# Altium schematic sheet PAGE1-CONTENTS.SchDoc
size A3
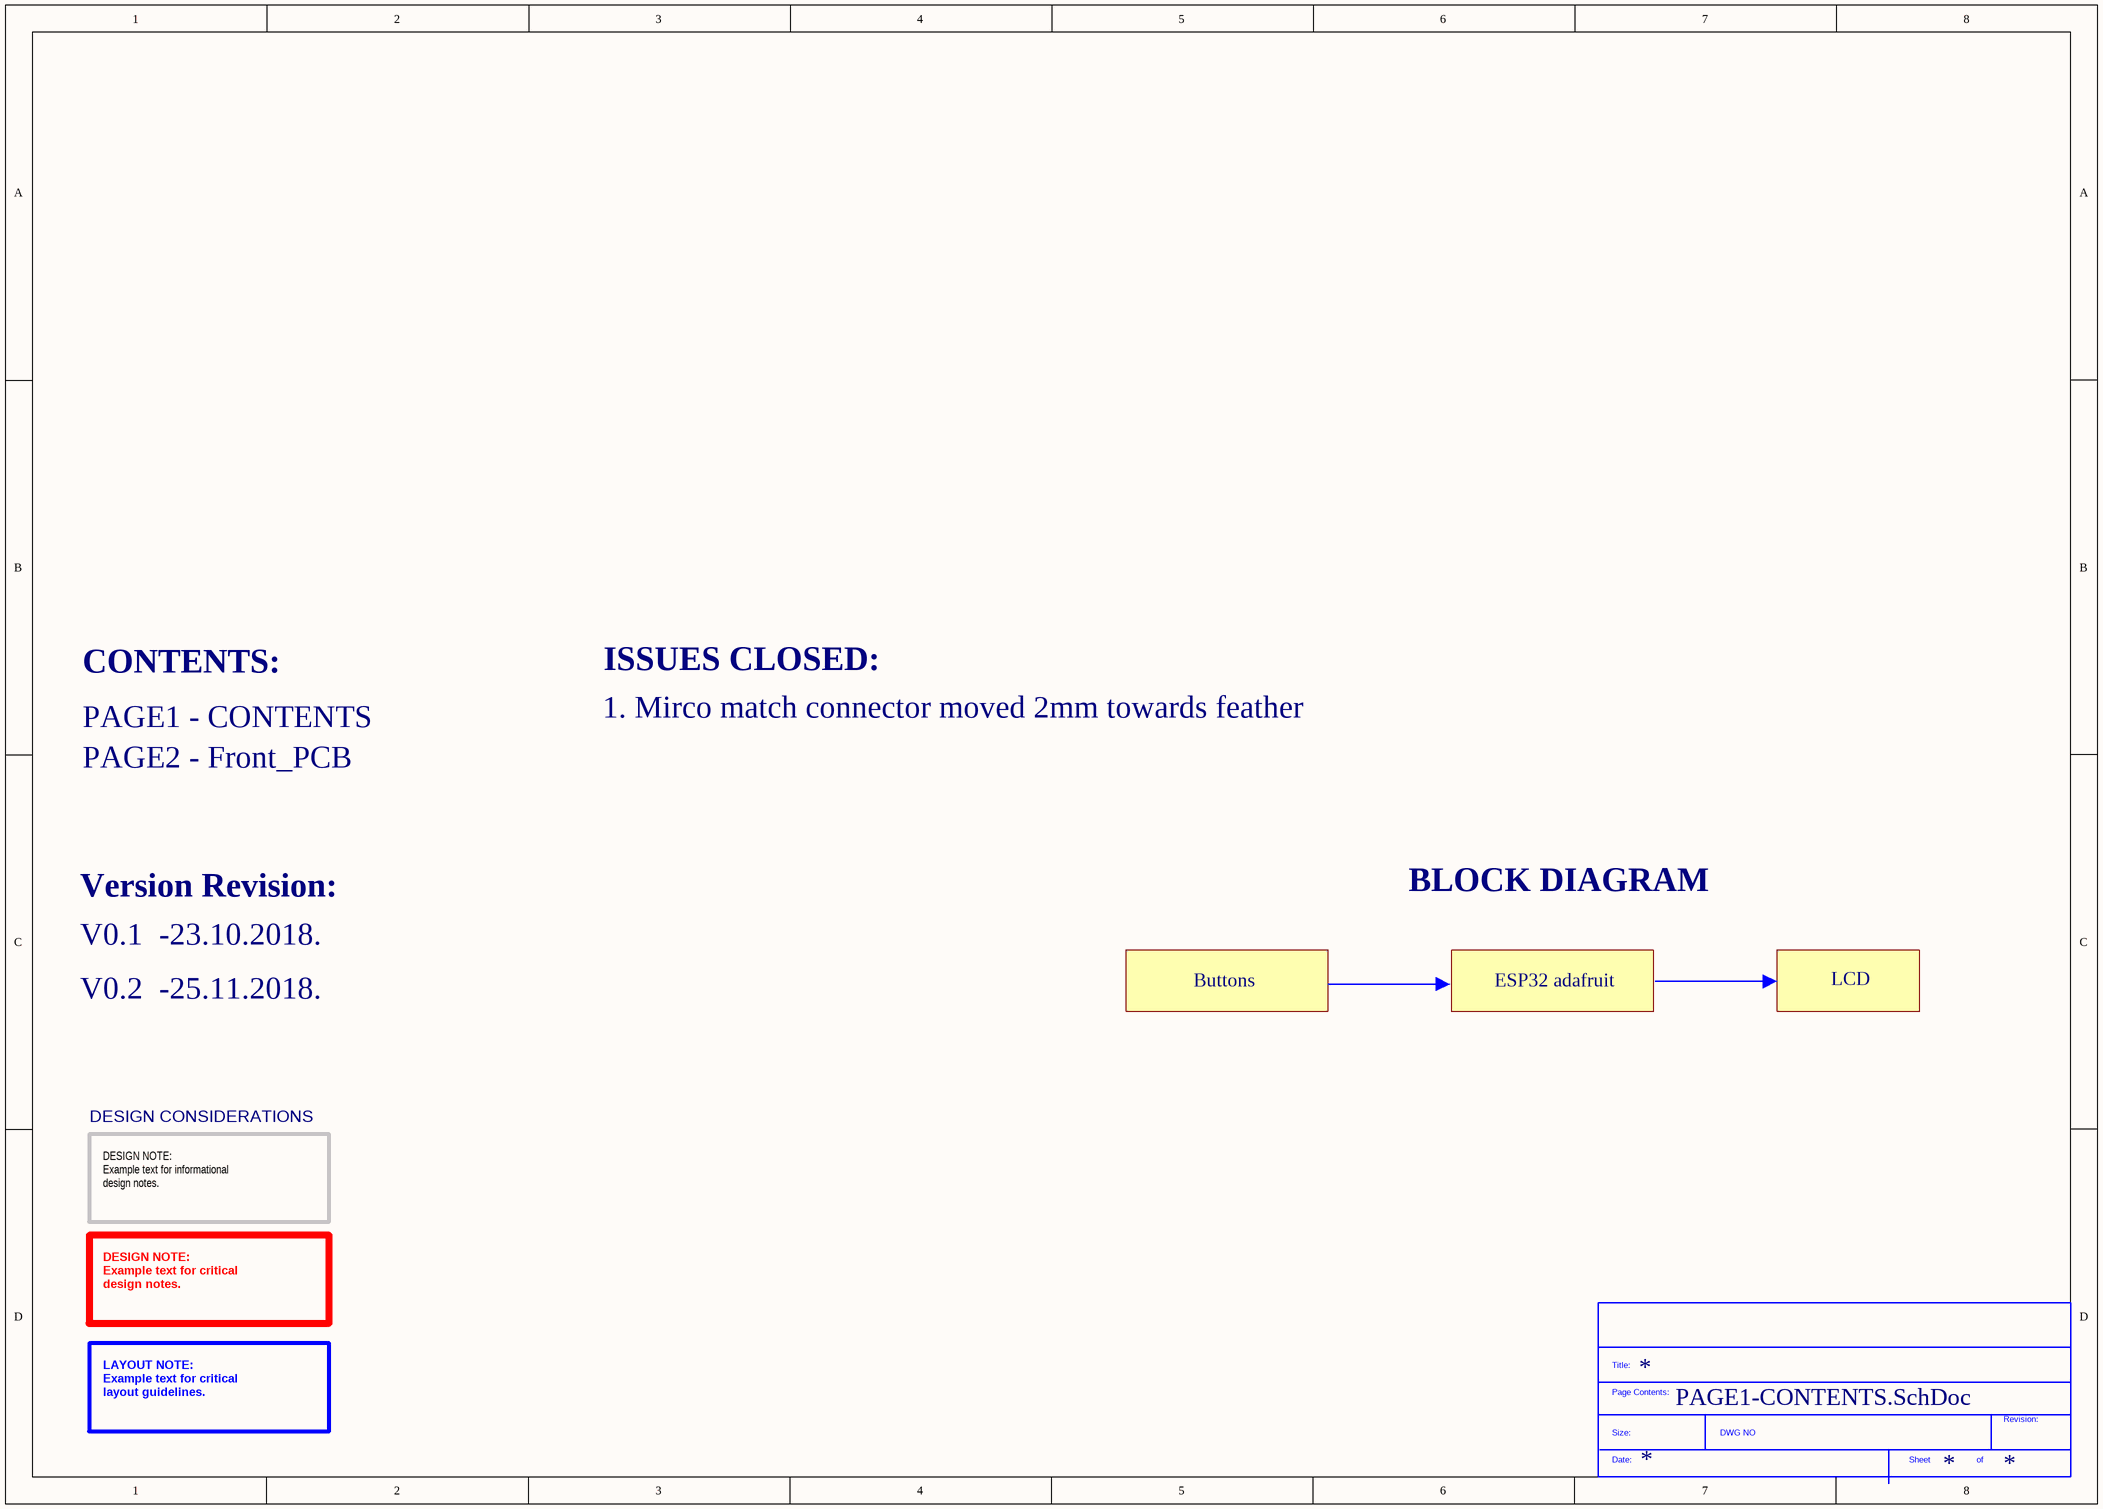
[diagram p0: PAGE1-CONTENTS.SchDoc]

## Parts
*?  SDTitleBlock  (value not drawn)  (graphical)

## Notes on the sheet
- CONTENTS:
- 1. Mirco match connector moved 2mm towards feather
- ISSUES CLOSED:
- PAGE1 - CONTENTS
- PAGE2 - Front_PCB
- Version Revision:
- BLOCK DIAGRAM
- V0.1  -23.10.2018.
- Buttons
- ESP32 adafruit
- LCD
- V0.2  -25.11.2018.
- DESIGN CONSIDERATIONS
- DESIGN NOTE:
  Example text for informational
  design notes.
- DESIGN NOTE:
  Example text for critical
  design notes.
- LAYOUT NOTE:
  Example text for critical
  layout guidelines.
- (in symbol SDTitleBlock) Title:; Page Contents:; Revision:; Size:; DWG NO; Date:; Sheet; of